# Altium schematic sheet IMU.SchDoc
size A3
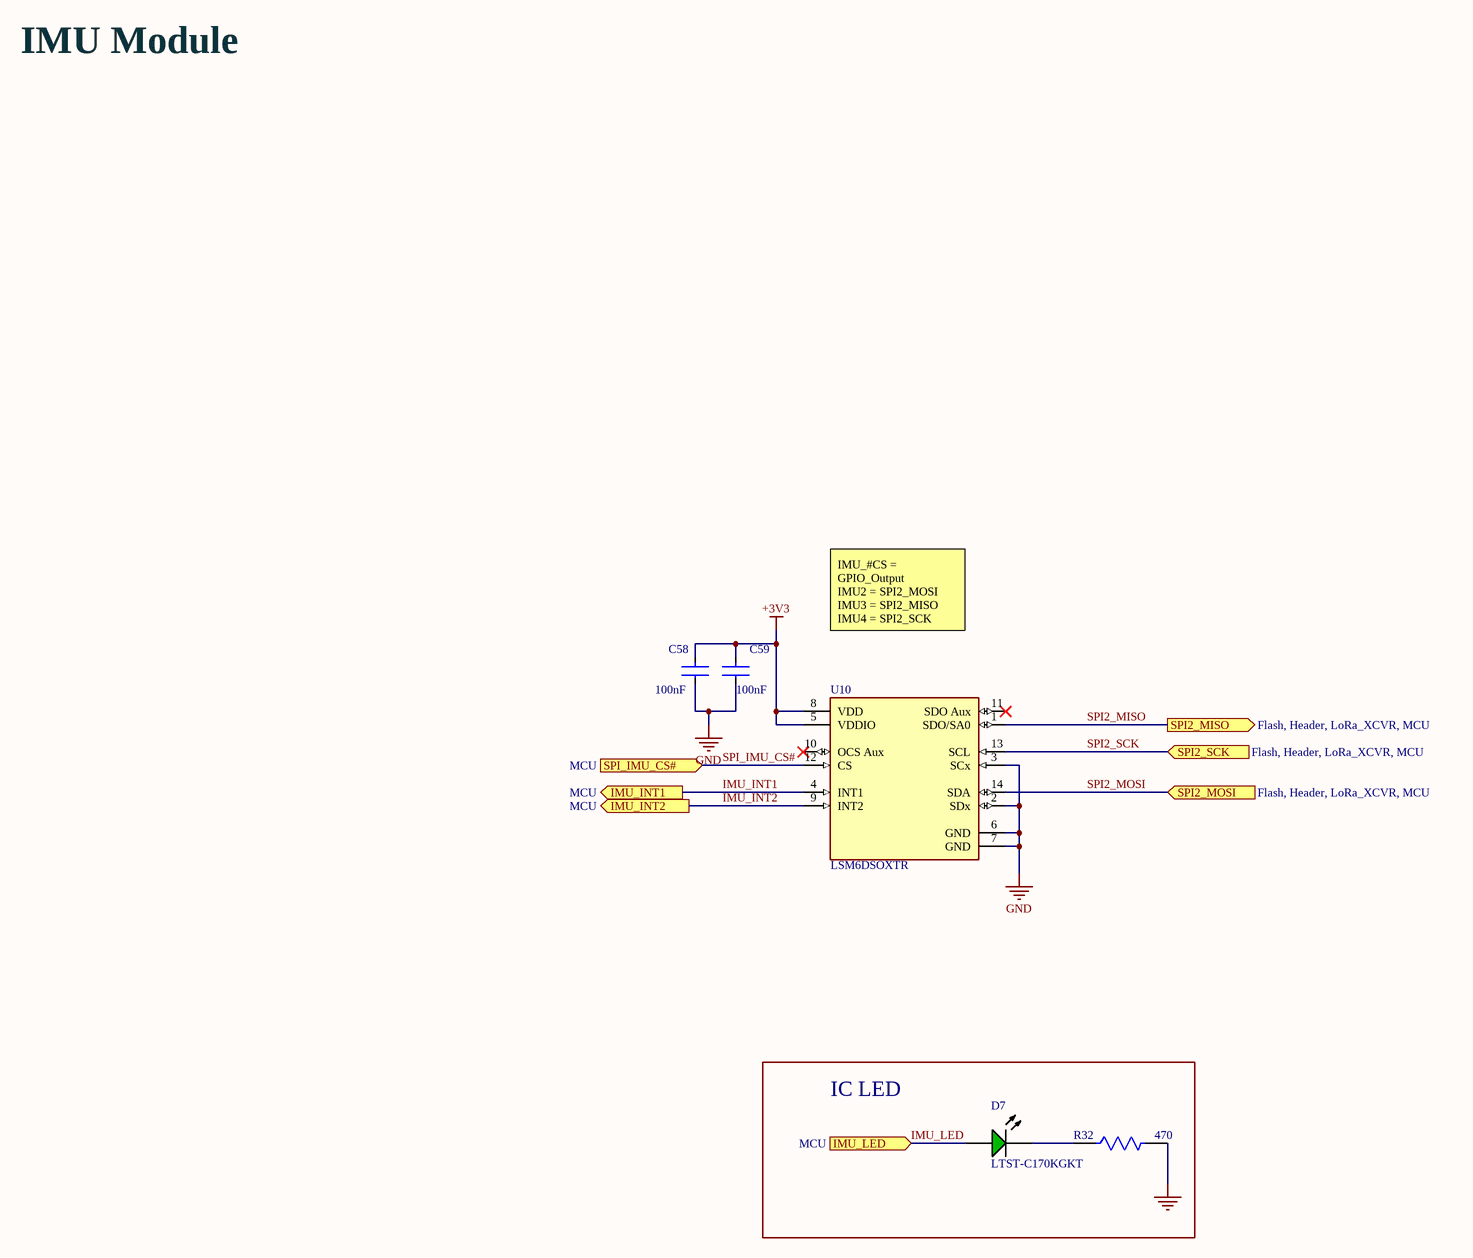
[diagram p0: IMU.SchDoc]

## Parts
C58  100nF  [FP-GRM15-MFG]
C59  100nF  [FP-GRM15-MFG]
D7  LTST-C170KGKT  [LTST-LTST-C170KGKT-2_V]
R32  470  [FP-CPF0603-MFG]
U10  LSM6DSOXTR  [FP-LGA-14L-DM00249496-MFG]

## Blocks framed on the sheet
IC LED: D7 R32

## Ports
IMU_INT1 (out, see MCU), IMU_INT2 (out, see MCU), IMU_LED (in, see MCU), SPI2_MISO (out, see Flash, Header, LoRa_XCVR, MCU), SPI2_MOSI (in, see Flash, Header, LoRa_XCVR, MCU), SPI2_SCK (in, see Flash, Header, LoRa_XCVR, MCU), SPI_IMU_CS# (in, see MCU)

## Nets
+3V3: C58.2 C59.2 U10.5(VDDIO) U10.8(VDD)
GND: C58.1 C59.1 R32.2 U10.2(SDx) U10.3(SCx) U10.6(GND) U10.7(GND)
IMU_INT1: U10.4(INT1) ; port IMU_INT1
IMU_INT2: U10.9(INT2) ; port IMU_INT2
IMU_LED: D7.2(A) ; port IMU_LED
SPI2_MISO: U10.1(SDO/SA0) ; port SPI2_MISO
SPI2_MOSI: U10.14(SDA) ; port SPI2_MOSI
SPI2_SCK: U10.13(SCL) ; port SPI2_SCK
SPI_IMU_CS#: U10.12(CS) ; port SPI_IMU_CS#
NetD7_1: D7.1(K) R32.1

Not connected (* = marked no-connect by the designer): U10 10(OCS_Aux)* 11(SDO_Aux)*

## Notes on the sheet
- IMU Module
- IMU_#CS = GPIO_Output
  IMU2 = SPI2_MOSI
  IMU3 = SPI2_MISO
  IMU4 = SPI2_SCK

## Library data of the parts
C58 C59 = CMP-2100-03641-2: CAP CER 0.1UF 16V X7R 0402; Manufacturer Part Number: GRM155R71C104KA88D; Manufacturer: Murata; Standoff Height: 0mm; Tolerance: 10%; Description: CAP Ceramic 0.10μF 10% X7R 16Vdc 0402 SMD; Voltage Rating: 16Vdc; Material: Ceramic; Capacitance: 0.10μF; Value: 0.10μF; RoHS: TRUE; Temperature Characteristic: X7R; Octopart: https://octopart.com/grm155r71c104ka88d-murata-196880; Digikey Description: CAP CER 0.1UF 16V X7R 0402; Device Class L3: Ceramic Capacitors; Height: 0.55mm; ComponentLink2Description: Datasheet; Temperature Range Low: -55°C; Ipc Land Pattern Name: CAPC10050X219; ComponentLink2URL: https://search.murata.co.jp/Ceramy/image/img/A01X/G101/ENG/GRM155R71H471KA01-01A.pdf; Device Class L1: Passive Components; Lead Free: yes; Category: Cap; Package: GRM15; Temperature: -55°C to +125°C; Device Class L2: Capacitors; Temperature Range High: +125°C; Mouser Description: 0402 0.1 uF 16V ±10 % Tolerance X7R SMT Multilayer Ceramic Capacitor
D7 = CMP-2000-06620-1: Ultra Bright AlInGaP Chip LED, 75 mW, -55 to 85 degC, 2-Pin SMD (0805), RoHS, Tape and Reel; Manufacturer: Lite-On; Forward Current: 30mA; Power Dissipation Max: 75mW; Emitting Color: YellowGreen; Type: Uni-Color; Forward Voltage: 2.4V; Dominant Wave Length: 571nm; Test Current (It): 20mA; Product Length (mm): 2mm; Peak Wavelength: 574nm; Power Dissipation: 75W; Product Depth (mm): 1.25mm; DELETED: Compliant; High Brightness: Yes; Product Height (mm): 1.1mm; Luminous Intensity: 35mcd; Shape Type: Rectangular; Chip Material: AlGaInP; Viewing Angle: 130deg; Number of  Elements: 1; Reverse Voltage: 5V; Rad Hardened: No; Package Type: ChipLed; Manufacturer URL: http://www.us.liteon.com/; Mounting: SurfaceMount; Operating Temp Range: -55Cto85C; Datasheet URL: http://optoelectronics.liteon.com/upload/download/DS22-2000-073/S_110_LTST-C170KGKT.pdf; Packaging: TapeandReel; Pin Count: 2; Package Description: 2-Pin Surface Mounted Device, Body 2 x 1.25 mm; Mounting Technology: SurfaceMount; Package Reference: LTST-C170KGKT-2; Forward Current Max: 30mA; Datasheet Version: Rev. G, 06/2005; Lens Dimensions: 1.4x1.25x0.6mm; Operating Temperature Classification: Industrial; Lum Intensity: 35mcd; Main Category: ChipLED
R32 = CMP-03211-004765-1: RES SMD 470Ω 0.1% 1/16W 0603 / CPF0603B470RE; Manufacturer: TE Connectivity; Temperature Coefficient: 25ppm/°C; Voltage Rating: 50V; Power Rating: 0.063W; Value: 470Ω; Device Class L3: Chip SMD Resistors; RoHS: TRUE; Category: Res; Device Class L2: Resistors; Series: CPF; Height: 0.55mm; Temperature: -55°C to +155°C; Temperature Range High: +155°C; Automotive: No; octopart_url: https://octopart.com/cpf0603b470re-te+connectivity-23376607; packaging: 5k Reel; ComponentLink2Description: Datasheet; Temperature Range Low: -55°C; Device Class L1: Passive Components; Ipc Land Pattern Name: RESC15580X45; Package: CPF0603; Composition: Thin Film; Manufacturer Part Number: CPF0603B470RE; Resistance: 470Ω; Octopart: https://octopart.com/cpf0603b470re-te+connectivity-23376607; Lead Free: Yes; ComponentLink2URL: https://www.te.com/commerce/DocumentDelivery/DDEController?Action=showdoc&DocId=Data+Sheet%7F1773200%7FM%7Fpdf%7FEnglish%7FENG_DS_1773200_M.pdf%7F3-1676481-2; Tolerance: 0.1%
U10 = CMP-12177-000010-1: INEMO INERTIAL MODULE: 3D ACCELE; Manufacturer: STMicroelectronics; Sensor Type: Temperature,Accelerometer,Gyroscope; Accel Range: 2/4/8/16g; Accel Sensitivity: 0.061/0.122/0.244/0.488mV/g; Operating Supply Current: 0.55mA; Gyro Range: 125/250/500/1000/2000°/s; Gyro Sensitivity: 4.375/8.75/17.5/35/70LSB/°/s; Sensor Output: I2C,SPI,Other; Min Supply Voltage: 1.62V; Max Supply Voltage: 3.6V; Octopart: https://octopart.com/lsm6dsoxtr-stmicroelectronics-98102600; Package: LGA-14L-DM00249496; Footprint Url: https://www.st.com/content/ccc/resource/technical/document/technical_note/73/17/9c/16/dd/96/4a/01/CD00134799.pdf/files/CD00134799.pdf/jcr:content/translations/en.CD00134799.pdf; ComponentLink2Description: Datasheet; Mouser Description: LSM6DSOX: 3.6 V 3 Axis Accelerometer Gyroscope iNEMO Inertial Module - LGA-14L; ComponentLink2URL: https://www.st.com/resource/en/datasheet/lsm6dsox.pdf; Temperature Range Low: -40°C; Digikey Description: INEMO INERTIAL MODULE: 3D ACCELE; Lead Free: Yes; Device Class L3: Inertial Measurement Units (IMUs); Category: IC; Device Class L2: Motion Sensors; RoHS: TRUE; Temperature: -40°C to +85°C; Height: 0.86mm; Device Class L1: Sensors; Temperature Range High: +85°C; Manufacturer Part Number: LSM6DSOXTR; Automotive: No